# Altium project core.PrjPcb
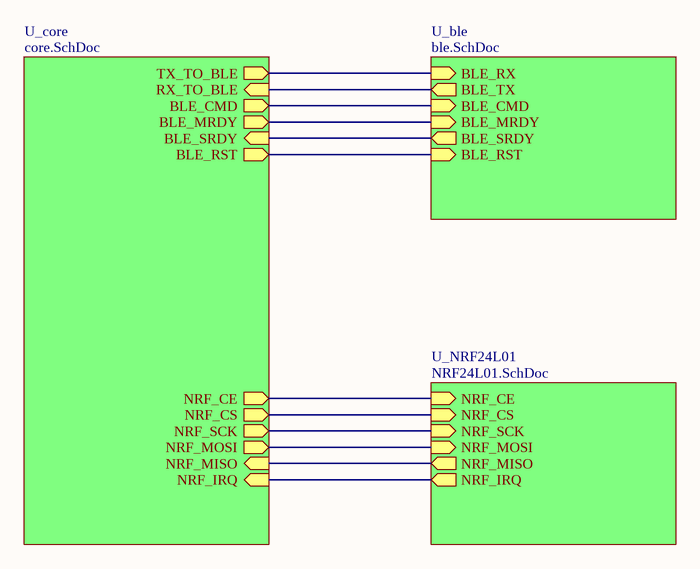
[diagram p0: top.SchDoc]
4 sheets, 67 parts. Net scope: hierarchical (ports join the sheet entries above them; power ports are global).
Board file: core_V1.0.PcbDoc
Sheets:
  top.SchDoc
    U_ble = ble.SchDoc
    U_core = core.SchDoc
    U_NRF24L01 = NRF24L01.SchDoc

## Sheet top.SchDoc
size A4

### Sub-sheets
U_ble = ble.SchDoc: BLE_RX (in), BLE_TX (out), BLE_CMD (in), BLE_MRDY (in), BLE_SRDY (out), BLE_RST (in)
U_core = core.SchDoc: NRF_CE (out), NRF_CS (out), NRF_SCK (out), NRF_MOSI (out), NRF_MISO (in), NRF_IRQ (in), RX_TO_BLE (in), TX_TO_BLE (out), BLE_CMD (out), BLE_MRDY (out), BLE_SRDY (in), BLE_RST (out)
U_NRF24L01 = NRF24L01.SchDoc: NRF_CE (in), NRF_CS (in), NRF_SCK (in), NRF_MOSI (in), NRF_MISO (out), NRF_IRQ (out)

### Nets
BLE_CMD: sheet U_ble/BLE_CMD, sheet U_core/BLE_CMD
BLE_MRDY: sheet U_ble/BLE_MRDY, sheet U_core/BLE_MRDY
BLE_RST: sheet U_ble/BLE_RST, sheet U_core/BLE_RST
BLE_RX: sheet U_ble/BLE_RX, sheet U_core/TX_TO_BLE
BLE_SRDY: sheet U_ble/BLE_SRDY, sheet U_core/BLE_SRDY
BLE_TX: sheet U_ble/BLE_TX, sheet U_core/RX_TO_BLE
CE: sheet U_core/NRF_CE, sheet U_NRF24L01/NRF_CE
CSN: sheet U_core/NRF_CS, sheet U_NRF24L01/NRF_CS
IRQ: sheet U_core/NRF_IRQ, sheet U_NRF24L01/NRF_IRQ
MISO: sheet U_core/NRF_MISO, sheet U_NRF24L01/NRF_MISO
MOSI: sheet U_core/NRF_MOSI, sheet U_NRF24L01/NRF_MOSI
NRF_SCK: sheet U_core/NRF_SCK, sheet U_NRF24L01/NRF_SCK

## Sheet ble.SchDoc
size A4
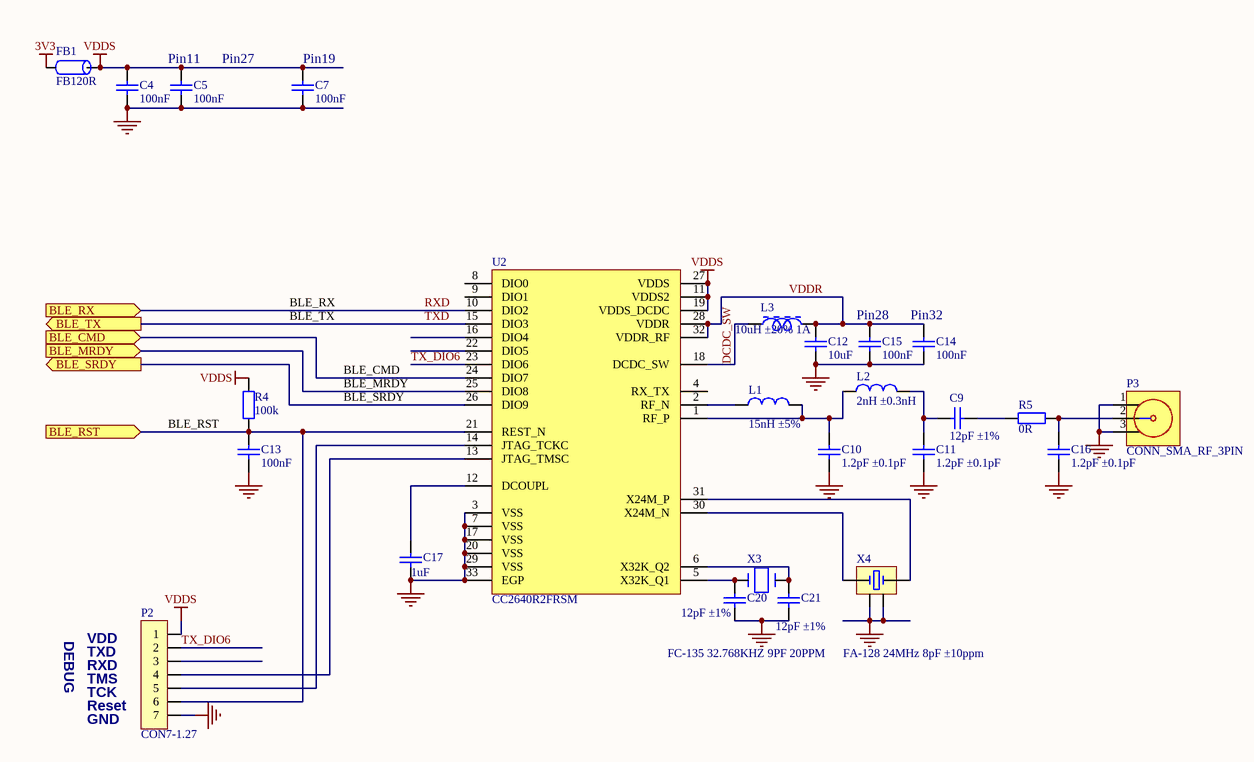
[diagram p1: ble.SchDoc]

### Parts
C4  100nF  [0402_C]
C5  100nF  [0402_C]
C7  100nF  [0402_C]
C9  12pF ±1%  [0402_C]
C10  1.2pF ±0.1pF  [0402_C]
C11  1.2pF ±0.1pF  [0402_C]
C12  10uF  [C0603]
C13  100nF  [0402_C]
C14  100nF  [0402_C]
C15  100nF  [0402_C]
C16  1.2pF ±0.1pF  [0402_C]
C17  1uF  [0402_C]
C20  12pF ±1%  [0402_C]
C21  12pF ±1%  [0402_C]
FB1  FB120R  [L0603]
L1  15nH ±5%  [LC-0402_L]
L2  2nH ±0.3nH  [LC-0402_L]
L3  10uH ±20% 1A  [L0805]
P2  CON7-1.27  [PH_7PIN_1.25_H-2]
P3  CONN_SMA_RF_3PIN  [PH_RF_2.5X2.5]
R4  100k  [0402_R]
R5  0R  [0402_R]
U2  CC2640R2FRSM  [VQFN-32_4x4x04P]
X3  FC-135 32.768KHZ 9PF 20PPM  [FC-135]
X4  FA-128 24MHz 8pF ±10ppm  [FA-128]

### Ports
BLE_CMD (in), BLE_MRDY (in), BLE_RST (in), BLE_RX (in), BLE_SRDY (out), BLE_TX (out)

### Nets
3V3: FB1.2
GND: C4.2 C5.2 C7.2 C10.1 C11.1 C12.1 C13.2 C14.2 C15.2 C16.1 C17.2 C20.1 C21.1 P2.7 P3.1 P3.3 U2.3(VSS) U2.7(VSS) U2.17(VSS) U2.20(VSS) U2.29(VSS) U2.33(EGP) X4.2 X4.4
VDDS: C4.1 C5.1 C7.1 FB1.1 P2.1 R4.2 U2.11(VDDS2) U2.19(VDDS_DCDC) U2.27(VDDS)
BLE_CMD: U2.24(DIO7) ; port BLE_CMD
BLE_MRDY: U2.25(DIO8) ; port BLE_MRDY
BLE_RST: C13.1 P2.6 R4.1 U2.21(REST_N) ; port BLE_RST
BLE_RX: U2.10(DIO2) ; port BLE_RX  [also labelled RXD]
BLE_SRDY: U2.26(DIO9) ; port BLE_SRDY
BLE_TX: U2.15(DIO3) ; port BLE_TX  [also labelled TXD]
DCDC_SW: L3.2 U2.18(DCDC_SW)
TX_DIO6: P2.2 U2.23(DIO6)
VDDR: C12.2 C14.1 C15.1 L3.1 U2.28(VDDR) U2.32(VDDR_RF)
NetC9_1: C9.1 R5.2
NetC9_2: C9.2 C11.2 L2.1
NetC10_2: C10.2 L1.1 L2.2 U2.1(RF_P)
NetC16_2: C16.2 P3.2 R5.1
NetC17_1: C17.1 U2.12(DCOUPL)
NetC20_2: C20.2 U2.5(X32K_Q1) X3.2
NetC21_2: C21.2 U2.6(X32K_Q2) X3.1
NetL1_2: L1.2 U2.2(RF_N)
NetP2_4: P2.4 U2.13(JTAG_TMSC)
NetP2_5: P2.5 U2.14(JTAG_TCKC)
NetU2_30: U2.30(X24M_N) X4.1
NetU2_31: U2.31(X24M_P) X4.3

Not connected (* = marked no-connect by the designer): P2 3; U2 4(RX_TX) 8(DIO0) 9(DIO1) 16(DIO4) 22(DIO5)

### Notes on the sheet
- (near C5) Pin11
- Pin27
- (near C7) Pin19
- (near C15) Pin28
- (near C14) Pin32
- (near P3) SMA
- DEBUG
- TMS
- TCK
- VDD
- TXD
- RXD
- GND
- (near P2) Reset

### Library data of the parts
C4 C5 C7 C13-C15 = Cap-0402_100n: 表贴电容0402,±10%,16V,X7R; Part Number: RP02.04.000221; LatestRevisionDate: 09-Feb-2017; LatestRevisionNote: SCHlib build; Publisher: ChenYinaho; PackageDescription: 0402C; Manufacturer: *; Manufacturer Part Number: *; Value: 100nF
C9 C20 C21 = Cap-0402_12p_mu_1%: 表贴陶瓷电容,0402,±1%,50V,C0G; Manufacturer: 村田; Manufacturer Part Number: GRM1555C1H120FA01D; Part Number: NEW; LatestRevisionDate: 09-Feb-2017; LatestRevisionNote: SCHlib build; Publisher: ChenYinaho; PackageDescription: C0402; Value: 12pF ±1%
C10 C11 C16 = Cap-0402_1.2p_mu: 表贴陶瓷电容,0402,±0.1pF,50V,C0G; Manufacturer: 村田; Manufacturer Part Number: GRM1555C1H1R2BA01D; Part Number: NEW; LatestRevisionDate: 09-Feb-2017; LatestRevisionNote: SCHlib build; Publisher: ChenYinaho; PackageDescription: C0402; Value: 1.2pF ±0.1pF
C12 = Cap-SMT-0603_10u: 表贴陶瓷电容,0603,±10%,10V; Manufacturer: YAGO; Part Number: RP02.04.000062; LatestRevisionDate: 09-Feb-2017; LatestRevisionNote: SCHlib build; Publisher: ChenYinaho; PackageDescription: C0603; Manufacturer Part Number: *; Value: 10uF
C17 = Cap-0402_1u: 表贴电容0402,±10%,6.3V; Part Number: RP02.04.000220; LatestRevisionDate: 09-Feb-2017; LatestRevisionNote: SCHlib build; Publisher: ChenYinaho; PackageDescription: 0402C; Manufacturer: *; Manufacturer Part Number: *; Value: 1uF
FB1 = FB_0603_120R: 贴片磁珠; Manufacturer: TDK; Part Number: RP02.99.000093; LatestRevisionDate: 09-Feb-2017; LatestRevisionNote: SCHlib build; Publisher: ChenYinaho; Manufacturer Part Number: *; Value: FB120R
L1 = Inductor_0402_15nH: 贴片电感 多层 0402 ±5% 450mA; Manufacturer: 村田; Manufacturer Part Number: LQG15HS15NJ02D; Part Number: NEW; LatestRevisionDate: 09-Feb-2017; LatestRevisionNote: SCHlib build; Publisher: ChenYinaho; Value: 15nH ±5%
L2 = Inductor_0402_2nH: 贴片电感 多层 0402 ±0.3nH 900mA; Manufacturer: 村田; Manufacturer Part Number: LQG15HS2N0S02D; Part Number: NEW; LatestRevisionDate: 09-Feb-2017; LatestRevisionNote: SCHlib build; Publisher: ChenYinaho; Value: 2nH ±0.3nH
L3 = Inductor_10uH_SL_0805: 贴片层叠电感; Manufacturer: Sunlord; Manufacturer Part Number: MPH201214S100MT; Part Number: NEW; LatestRevisionDate: 09-Feb-2017; LatestRevisionNote: SCHlib build; Publisher: ChenYinaho; Value: 10uH ±20% 1A
P2 = CON7: 直插插座; Part Number: RP02.07.000049; LatestRevisionDate: 09-Feb-2017; LatestRevisionNote: SCHlib build; Publisher: ChenYinaho; Manufacturer: *; Manufacturer Part Number: *; Value: CON7-1.27
P3 = CONN_SMA_RF_3PIN: 贴片天线座; Part Number: RP02.07.000078; LatestRevisionDate: 09-Feb-2017; LatestRevisionNote: SCHlib build; Publisher: ChenYinaho; Manufacturer: *; Manufacturer Part Number: *; Value: CONN_SMA_RF_3PIN
R4 = Res-0402_100k: 表贴电阻,0402,±1%,1/16W; Part Number: NEW; LatestRevisionDate: 09-Feb-2017; LatestRevisionNote: SCHlib build; Publisher: ChenYinaho; PackageDescription: 0402R; Manufacturer: *; Manufacturer Part Number: *; Value: 100k
R5 = Res-0402_0R: 表贴电阻,0402,±1%,1/16W; Part Number: NEW; LatestRevisionDate: 09-Feb-2017; LatestRevisionNote: SCHlib build; Publisher: ChenYinaho; PackageDescription: 0402R; Manufacturer: *; Manufacturer Part Number: *; Value: 0R
U2 = CC2640R2FRSM: 无线收发芯片; Manufacturer: TI; Part Number: NEW; LatestRevisionDate: 09-Feb-2017; LatestRevisionNote: SCHlib build; Publisher: ChenYinaho; Manufacturer Part Number: CC2640R2FRSM; Value: CC2640R2FRSM; PackageDescription: VQFN-32_4x4x04P
X3 = XTAL-3215_2P_32k_9pF: 贴片无源晶体3215; Manufacturer: EPSON(爱普生); Part Number: NEW; LatestRevisionDate: 09-Feb-2017; LatestRevisionNote: SCHlib build; Publisher: ChenYinaho; Manufacturer Part Number: FC-13532.768KHZ9PF20PPM; Value: FC-135 32.768KHZ 9PF 20PPM
X4 = XTAL-2016_4P_24M_8pF: 贴片无源晶体2016; Manufacturer: EPSON(爱普生); Manufacturer Part Number: Q22FA12800120; Part Number: NEW; LatestRevisionDate: 09-Feb-2017; LatestRevisionNote: SCHlib build; Publisher: ChenYinaho; Value: FA-128 24MHz 8pF ±10ppm

## Sheet core.SchDoc
size A4
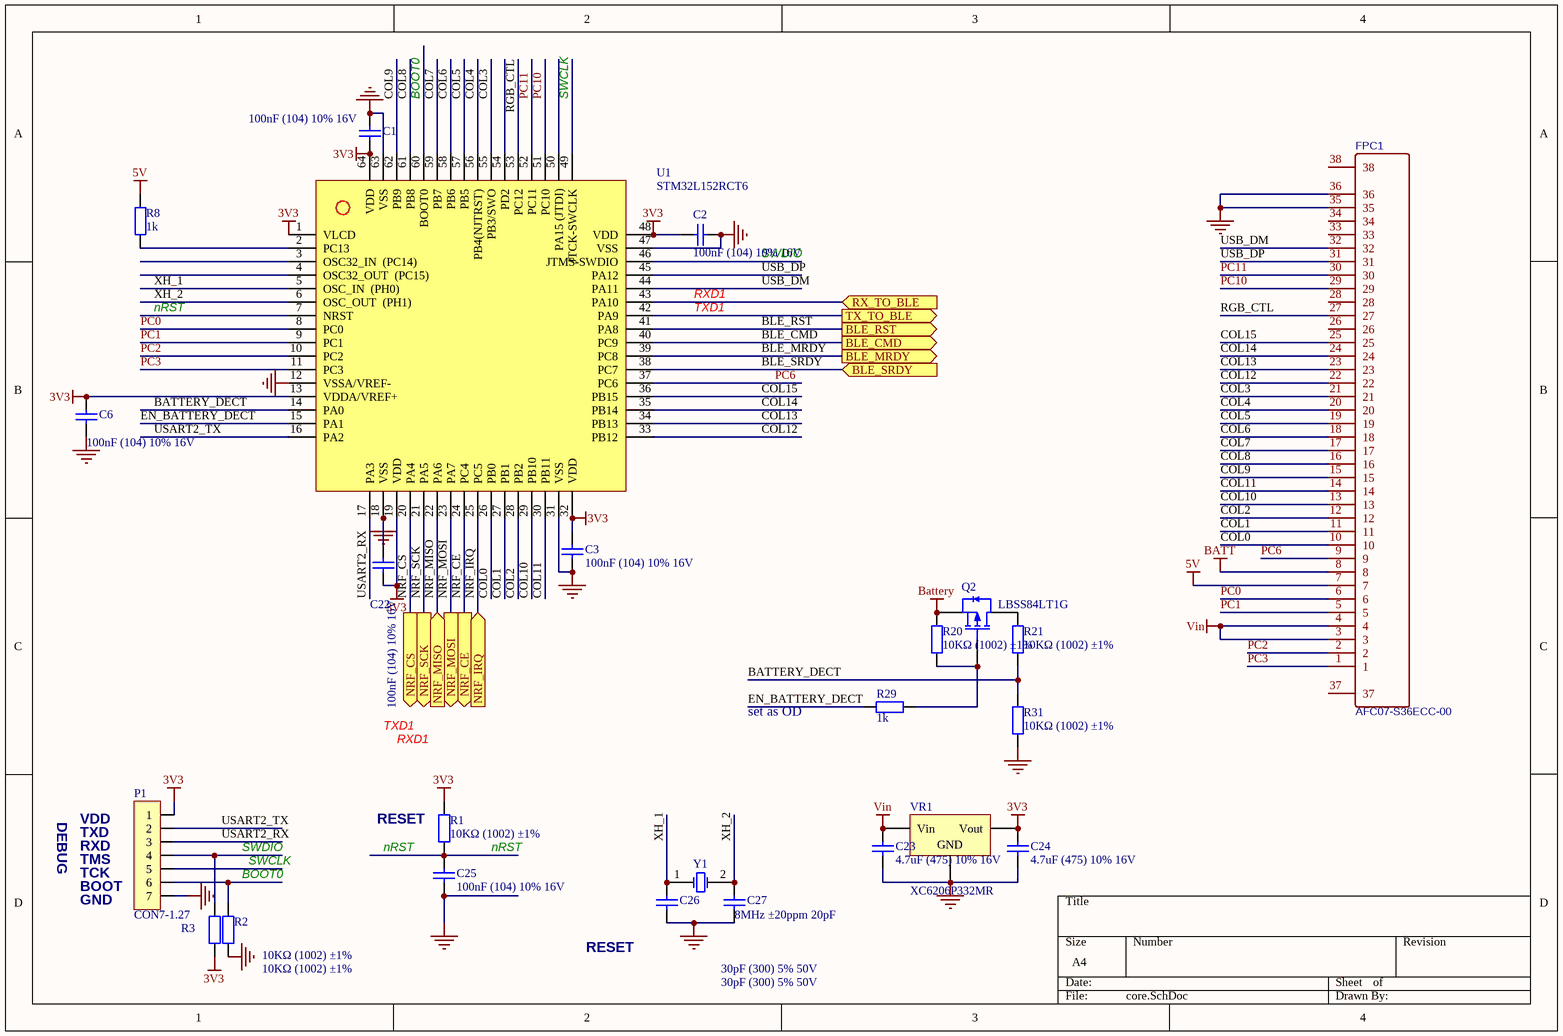
[diagram p2: core.SchDoc]

### Parts
C1  100nF (104) 10% 16V  [0402_C]
C2  100nF (104) 10% 16V  [0402_C]
C3  100nF (104) 10% 16V  [0402_C]
C6  100nF (104) 10% 16V  [0402_C]
C22  100nF (104) 10% 16V  [0402_C]
C23  4.7uF (475) 10% 16V  [0603_C]
C24  4.7uF (475) 10% 16V  [0603_C]
C25  100nF (104) 10% 16V  [0402_C]
C26  30pF (300) 5% 50V  [0402_C]
C27  30pF (300) 5% 50V  [0402_C]
FPC1  AFC07-S36ECC-00  [FPC-0.5MM-36P-LCS-SJ-H2.0]
P1  CON7-1.27  [PH_7PIN_1.25_H-2]
Q2  LBSS84LT1G  [sot-23]
R1  10KΩ (1002) ±1%  [0402_R]
R2  10KΩ (1002) ±1%  [0402_R]
R3  10KΩ (1002) ±1%  [0402_R]
R8  1k  [0402_R]
R20  10KΩ (1002) ±1%  [0402_R]
R21  10KΩ (1002) ±1%  [0402_R]
R29  1k  [0402_R]
R31  10KΩ (1002) ±1%  [0402_R]
U1  STM32L152RCT6  [LQFP64]
VR1  XC6206P332MR  [SOT-23-3L]
Y1  8MHz ±20ppm 20pF  [SMD-5032_2P]

### Ports
BLE_CMD (out), BLE_MRDY (out), BLE_RST (out), BLE_SRDY (in), NRF_CE (out), NRF_CS (out), NRF_IRQ (in), NRF_MISO (in), NRF_MOSI (out), NRF_SCK (out), RX_TO_BLE (in), TX_TO_BLE (out)

### Nets
3V3: C1.1 C2.2 C3.2 C6.2 C22.1 C24.2 P1.1 R1.2 R3.1 U1.1(VLCD) U1.13(VDDA/VREF+) U1.19(VDD) U1.32(VDD) U1.48(VDD) U1.64(VDD) VR1.2(Vout)
5V: FPC1.7 R8.1
BATT: FPC1.8
Battery: Q2.2(S) R20.2
GND: C1.2 C2.1 C3.1 C6.1 C22.2 C23.1 C24.1 C25.1 C26.1 C27.1 FPC1.35 FPC1.36 P1.7 R2.1 R31.1 U1.12(VSSA/VREF-) U1.18(VSS) U1.31(VSS) U1.47(VSS) U1.63(VSS) VR1.1(GND)
Vin: C23.2 FPC1.3 FPC1.4 VR1.3(Vin)
BATTERY_DECT: R21.1 R31.2 U1.14(PA0)
BLE_CMD: U1.40(PC9) ; port BLE_CMD
BLE_MRDY: U1.39(PC8) ; port BLE_MRDY
BLE_RST: U1.41(PA8) ; port BLE_RST
BLE_SRDY: U1.38(PC7) ; port BLE_SRDY
BOOT0: P1.6 R2.2 U1.60(BOOT0)
COL0: FPC1.10 U1.26(PB0)
COL1: FPC1.11 U1.27(PB1)
COL2: FPC1.12 U1.28(PB2)
COL3: FPC1.21 U1.55(PB3/SWO)
COL4: FPC1.20 U1.56(PB4(NJTRST))
COL5: FPC1.19 U1.57(PB5)
COL6: FPC1.18 U1.58(PB6)
COL7: FPC1.17 U1.59(PB7)
COL8: FPC1.16 U1.61(PB8)
COL9: FPC1.15 U1.62(PB9)
COL10: FPC1.13 U1.29(PB10)
COL11: FPC1.14 U1.30(PB11)
COL12: FPC1.22 U1.33(PB12)
COL13: FPC1.23 U1.34(PB13)
COL14: FPC1.24 U1.35(PB14)
COL15: FPC1.25 U1.36(PB15)
EN_BATTERY_DECT: R29.2 U1.15(PA1)
NRF_CE: U1.24(PC4) ; port NRF_CE  [project net CE]
NRF_CS: U1.20(PA4) ; port NRF_CS  [project net CSN]
NRF_IRQ: U1.25(PC5) ; port NRF_IRQ  [project net IRQ]
NRF_MISO: U1.22(PA6) ; port NRF_MISO  [project net MISO]
NRF_MOSI: U1.23(PA7) ; port NRF_MOSI  [project net MOSI]
NRF_SCK: U1.21(PA5) ; port NRF_SCK
nRST: C25.2 R1.1 U1.7(NRST)
PC0: FPC1.6 U1.8(PC0)
PC1: FPC1.5 U1.9(PC1)
PC2: FPC1.2 U1.10(PC2)
PC3: FPC1.1 U1.11(PC3)
PC6: FPC1.9 U1.37(PC6)
PC10: FPC1.29 U1.51(PC10)
PC11: FPC1.30 U1.52(PC11)
RGB_CTL: FPC1.27 U1.53(PC12)
RXD1: U1.43(PA10) ; port RX_TO_BLE  [project net BLE_TX]
SWCLK: P1.5 U1.49(JTCK-SWCLK)
SWDIO: P1.4 R3.2 U1.46(JTMS-SWDIO)
TXD1: U1.42(PA9) ; port TX_TO_BLE  [project net BLE_RX]
USART2_RX: P1.3 U1.17(PA3)
USART2_TX: P1.2 U1.16(PA2)
USB_DM: FPC1.32 U1.44(PA11)
USB_DP: FPC1.31 U1.45(PA12)
XH_1: C26.2 U1.5(OSC_IN__(PH0)) Y1.1(OSC1)
XH_2: C27.2 U1.6(OSC_OUT__(PH1)) Y1.2(OSC2)
NetQ2_1: Q2.1(G) R20.1 R29.1
NetQ2_3: Q2.3(D) R21.2
NetR8_2: R8.2 U1.2(PC13)

Not connected (* = marked no-connect by the designer): FPC1 26 28 33 34 37 38; U1 3(OSC32_IN__(PC14)) 4(OSC32_OUT__(PC15)) 50(PA15_(JTDI)) 54(PD2)

### Notes on the sheet
- set as OD
- DEBUG
- VDD
- TXD
- RXD
- (near R1) RESET
- TMS
- TCK
- GND
- (near P1) BOOT
- RESET
- Labels drawn without touching a wire or pin: RXD1, TXD1

### Library data of the parts
C1-C3 C6 C22 C25 = 0402 100nF (104) 10% 16V: 贴片电容; ComponentLink1Description: 供应商链接; ComponentLink1URL: http://www.szlcsc.com/product/details_1877.html; Package: 0402; Supplier: LC; SuppliersPartNumber: C1525
C23 C24 = 0603 4.7uF (475) 10% 16V: 贴片电容; ComponentLink1Description: 供应商链接; ComponentLink1URL: http://www.szlcsc.com/product/details_20375.html; Package: 0603; Supplier: LC; SuppliersPartNumber: C19666
C26 C27 = 0402 30pF (300) 5% 50V: 贴片电容; ComponentLink1Description: 供应商链接; ComponentLink1URL: http://www.szlcsc.com/product/details_1922.html; Package: 0402; Supplier: LC; SuppliersPartNumber: C1570
FPC1 = AFC07-S36ECC-00: BOM_Manufacturer: JUSHUO; Contributor: LCSC; BOM_Supplier: LCSC; BOM_Supplier Part: C262254; BOM_Manufacturer Part: AFC07-S36ECC-00; spicePre: F
P1 = CON7: 直插插座; Part Number: RP02.07.000049; LatestRevisionDate: 09-Feb-2017; LatestRevisionNote: SCHlib build; Publisher: ChenYinaho; Manufacturer: *; Manufacturer Part Number: *; Value: CON7-1.27
Q2 = P-MOS_BSS84: P-MOSFET -50V,-0.13A,10Ω@-5V; Manufacturer: LRC(乐山无线电); Part Number: NEW; LatestRevisionDate: 09-Feb-2017; LatestRevisionNote: SCHlib build; Publisher: ChenYinaho; PackageDescription: SOT-23(SOT-23-3); Manufacturer Part Number: LBSS84LT1G; Value: LBSS84LT1G
R1-R3 R20 R21 R31 = 0402 10KΩ (1002) 1%: 贴片电阻; ComponentLink1Description: 供应商链接; ComponentLink1URL: http://www.szlcsc.com/product/details_26487.html; Package: 0402; Supplier: LC; SuppliersPartNumber: C25744
R8 R29 = Res-0402_1k: 表贴电阻,0402,±1%,1/16W; Part Number: RP02.03.000161; LatestRevisionDate: 09-Feb-2017; LatestRevisionNote: SCHlib build; Publisher: ChenYinaho; PackageDescription: 0402R; Manufacturer: *; Manufacturer Part Number: *; Value: 1k
U1 = STM32L152RCT: MCU IC; Manufacturer: ST; Part Number: NEW; LatestRevisionDate: 09-Feb-2017; LatestRevisionNote: SCHlib build; Publisher: ChenYinaho; Manufacturer Part Number: STM32L152RCT6; Value: STM32L152RCT6
VR1 = SOT-23 XC6206P332MR: 低压差线性稳压(LDO); ComponentLink1Description: 供应商链接; ComponentLink1URL: http://www.szlcsc.com/product/details_5896.html; Package: SOT-23; Supplier: LC; SuppliersPartNumber: C5446
Y1 = SMD-5032_2P 8MHz 20ppm 20pF: 贴片晶振; ComponentLink1Description: 供应商链接; ComponentLink1URL: http://www.szlcsc.com/product/details_117214.html; Package: SMD-5032_2P; Supplier: LC; SuppliersPartNumber: C115962

## Sheet NRF24L01.SchDoc
size A4
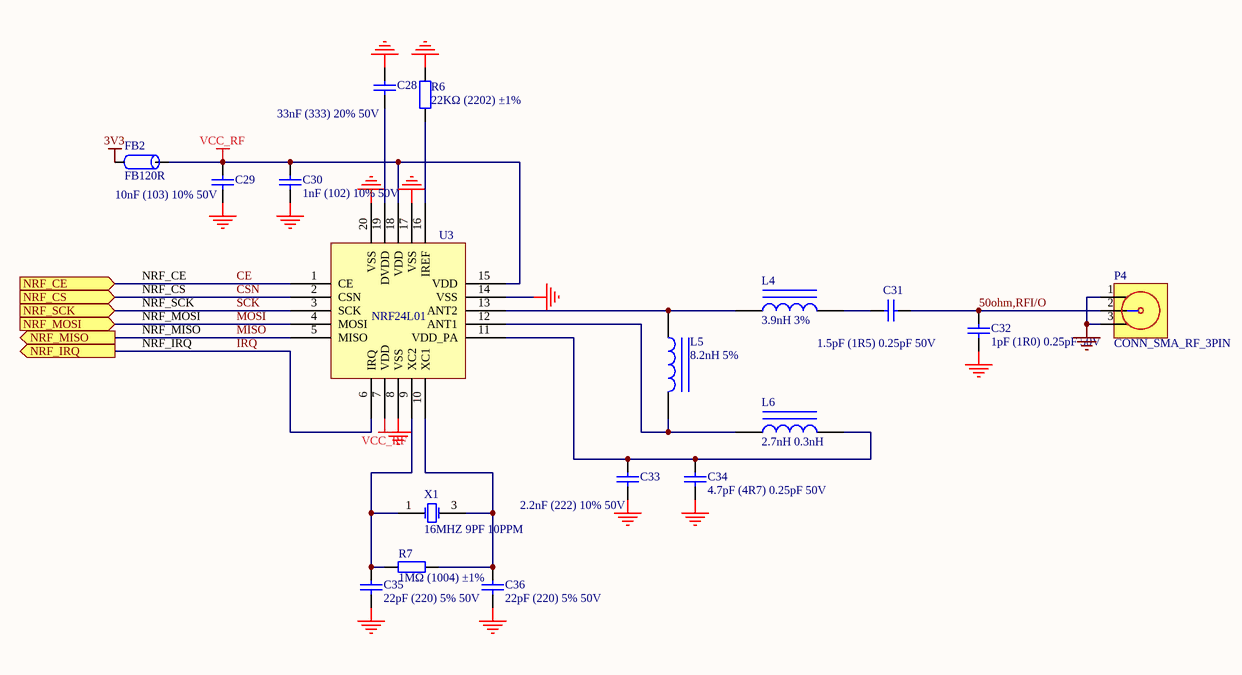
[diagram p3: NRF24L01.SchDoc]

### Parts
C28  33nF (333) 20% 50V  [0402_C]
C29  10nF (103) 10% 50V  [0402_C]
C30  1nF (102) 10% 50V  [0402_C]
C31  1.5pF (1R5) 0.25pF 50V  [0402_C]
C32  1pF (1R0) 0.25pF 50V  [0402_C]
C33  2.2nF (222) 10% 50V  [0402_C]
C34  4.7pF (4R7) 0.25pF 50V  [0402_C]
C35  22pF (220) 5% 50V  [0402_C]
C36  22pF (220) 5% 50V  [0402_C]
FB2  FB120R  [L0603]
L4  3.9nH 3%  [0402_L]
L5  8.2nH 5%  [0402_L]
L6  2.7nH 0.3nH  [0402_L]
P4  CONN_SMA_RF_3PIN  [PH_RF_2.5X2.5]
R6  22KΩ (2202) ±1%  [0402_R]
R7  1MΩ (1004) ±1%  [0402_R]
U3  NRF24L01  [QFN-20_4X4X05P]
X1  16MHZ 9PF 10PPM  [SMD-3225_4P]

### Ports
NRF_CE (in), NRF_CS (in), NRF_IRQ (out), NRF_MISO (out), NRF_MOSI (in), NRF_SCK (in)

### Nets
3V3: FB2.2
GND: C28.2 C29.1 C30.1 C32.1 C33.1 C34.1 C35.1 C36.1 P4.1 P4.3 R6.2 U3.8(VSS) U3.14(VSS) U3.17(VSS) U3.20(VSS)
VCC_RF: C29.2 C30.2 FB2.1 U3.7(VDD) U3.15(VDD) U3.18(VDD)
50ohm,RFI/O: C31.2 C32.2 P4.2
CE: U3.1(CE) ; port NRF_CE  [also labelled NRF_CE]
CSN: U3.2(CSN) ; port NRF_CS  [also labelled NRF_CS]
IRQ: U3.6(IRQ) ; port NRF_IRQ  [also labelled NRF_IRQ]
MISO: U3.5(MISO) ; port NRF_MISO  [also labelled NRF_MISO]
MOSI: U3.4(MOSI) ; port NRF_MOSI  [also labelled NRF_MOSI]
NRF_SCK: U3.3(SCK) ; port NRF_SCK  [also labelled SCK]
NetC28_1: C28.1 U3.19(DVDD)
NetC31_1: C31.1 L4.2
NetC33_2: C33.2 C34.2 L6.2 U3.11(VDD_PA)
NetC35_2: C35.2 R7.1 U3.9(XC2) X1.1(OSC1)
NetC36_2: C36.2 R7.2 U3.10(XC1) X1.3(OSC2)
NetL4_1: L4.1 L5.1 U3.13(ANT2)
NetL5_2: L5.2 L6.1 U3.12(ANT1)
NetR6_1: R6.1 U3.16(IREF)

### Notes on the sheet
- (near P4) SMA

### Library data of the parts
C28 = 0402 33nF (333) 20% 50V: 贴片电容; ComponentLink1Description: 供应商链接; ComponentLink1URL: http://www.szlcsc.com/product/details_1937.html; Package: 0402; Supplier: LC; SuppliersPartNumber: C1585
C29 = 0402 10nF (103) 10% 50V: 贴片电容; ComponentLink1Description: 供应商链接; ComponentLink1URL: http://www.szlcsc.com/product/details_15869.html; Package: 0402; Supplier: LC; SuppliersPartNumber: C15195
C30 = 0402 1nF (102) 10% 50V: 贴片电容; ComponentLink1Description: 供应商链接; ComponentLink1URL: http://www.szlcsc.com/product/details_1875.html; Package: 0402; Supplier: LC; SuppliersPartNumber: C1523
C31 = 0402 1.5pF (1R5) 0.25pF 50V: 贴片电容; ComponentLink1Description: 供应商链接; ComponentLink1URL: http://www.szlcsc.com/product/details_1904.html; Package: 0402; Supplier: LC; SuppliersPartNumber: C1552
C32 = 0402 1pF (1R0) 0.25pF 50V: 贴片电容; ComponentLink1Description: 供应商链接; ComponentLink1URL: http://www.szlcsc.com/product/details_1902.html; Package: 0402; Supplier: LC; SuppliersPartNumber: C1550
C33 = 0402 2.2nF (222) 10% 50V: 贴片电容; ComponentLink1Description: 供应商链接; ComponentLink1URL: http://www.szlcsc.com/product/details_1883.html; Package: 0402; Supplier: LC; SuppliersPartNumber: C1531
C34 = 0402 4.7pF (4R7) 0.25pF 50V: 贴片电容; ComponentLink1Description: 供应商链接; ComponentLink1URL: http://www.szlcsc.com/product/details_1921.html; Package: 0402; Supplier: LC; SuppliersPartNumber: C1569
C35 C36 = 0402 22pF (220) 5% 50V: 贴片电容; ComponentLink1Description: 供应商链接; ComponentLink1URL: http://www.szlcsc.com/product/details_1907.html; Package: 0402; Supplier: LC; SuppliersPartNumber: C1555
FB2 = FB_0603_120R: as FB1 on sheet ble; LatestRevisionDate: 09-Feb-2017; LatestRevisionNote: SCHlib build; Publisher: ChenYinaho; Manufacturer Part Number: *; Value: FB120R
L4 = 0402 3.9nH 3%: 贴片电感; ComponentLink1Description: 供应商链接; ComponentLink1URL: http://www.szlcsc.com/product/details_14690.html; Package: 0402; Supplier: LC; SuppliersPartNumber: C14033
L5 = 0402 8.2nH 5%: 贴片电感; ComponentLink1Description: 供应商链接; ComponentLink1URL: http://www.szlcsc.com/product/details_16890.html; Package: 0402; Supplier: LC; SuppliersPartNumber: C16208
L6 = 0402 2.7nH 0.3nH: 贴片电感; ComponentLink1Description: 供应商链接; ComponentLink1URL: http://www.szlcsc.com/product/details_27872.html; Package: 0402; Supplier: LC; SuppliersPartNumber: C27123
P4 = CONN_SMA_RF_3PIN: 贴片天线座; Part Number: RP02.07.000078; LatestRevisionDate: 09-Feb-2017; LatestRevisionNote: SCHlib build; Publisher: ChenYinaho; Manufacturer: *; Manufacturer Part Number: *; Value: CONN_SMA_RF_3PIN
R6 = 0402 22KΩ (2202) 1%: 贴片电阻; ComponentLink1Description: 供应商链接; ComponentLink1URL: http://www.szlcsc.com/product/details_26511.html; Package: 0402; Supplier: LC; SuppliersPartNumber: C25768
R7 = 0402 1MΩ (1004) 1%: 贴片电阻; ComponentLink1Description: 供应商链接; ComponentLink1URL: http://www.szlcsc.com/product/details_26826.html; Package: 0402; Supplier: LC; SuppliersPartNumber: C26083
X1 = SMD-3225_4P  16MHZ 9PF 10PPM: 贴片晶振; ComponentLink1Description: 供应商链接; ComponentLink1URL: http://www.szlcsc.com/product/details_14393.html; Package: SMD-3225_4P; Supplier: LC; SuppliersPartNumber: C13738

## Nets that join several sheets
3V3: ble (FB1.2), core (16 pins), NRF24L01 (FB2.2)
GND: ble (24 pins), core (21 pins), NRF24L01 (15 pins)
BLE_CMD: ble (U2.24), core (U1.40)
BLE_MRDY: ble (U2.25), core (U1.39)
BLE_RST: ble (C13.1 P2.6 R4.1 U2.21), core (U1.41)
BLE_RX: ble (U2.10), core (U1.42)
BLE_SRDY: ble (U2.26), core (U1.38)
BLE_TX: ble (U2.15), core (U1.43)
CE: core (U1.24), NRF24L01 (U3.1)
CSN: core (U1.20), NRF24L01 (U3.2)
IRQ: core (U1.25), NRF24L01 (U3.6)
MISO: core (U1.22), NRF24L01 (U3.5)
MOSI: core (U1.23), NRF24L01 (U3.4)
NRF_SCK: core (U1.21), NRF24L01 (U3.3)